# Altium schematic sheet UHF Transceiver Schematic.SchDoc: OCP UHF Transceiver
size Letter; Revision: 1.00; SheetNumber: 1; SheetTotal: 13
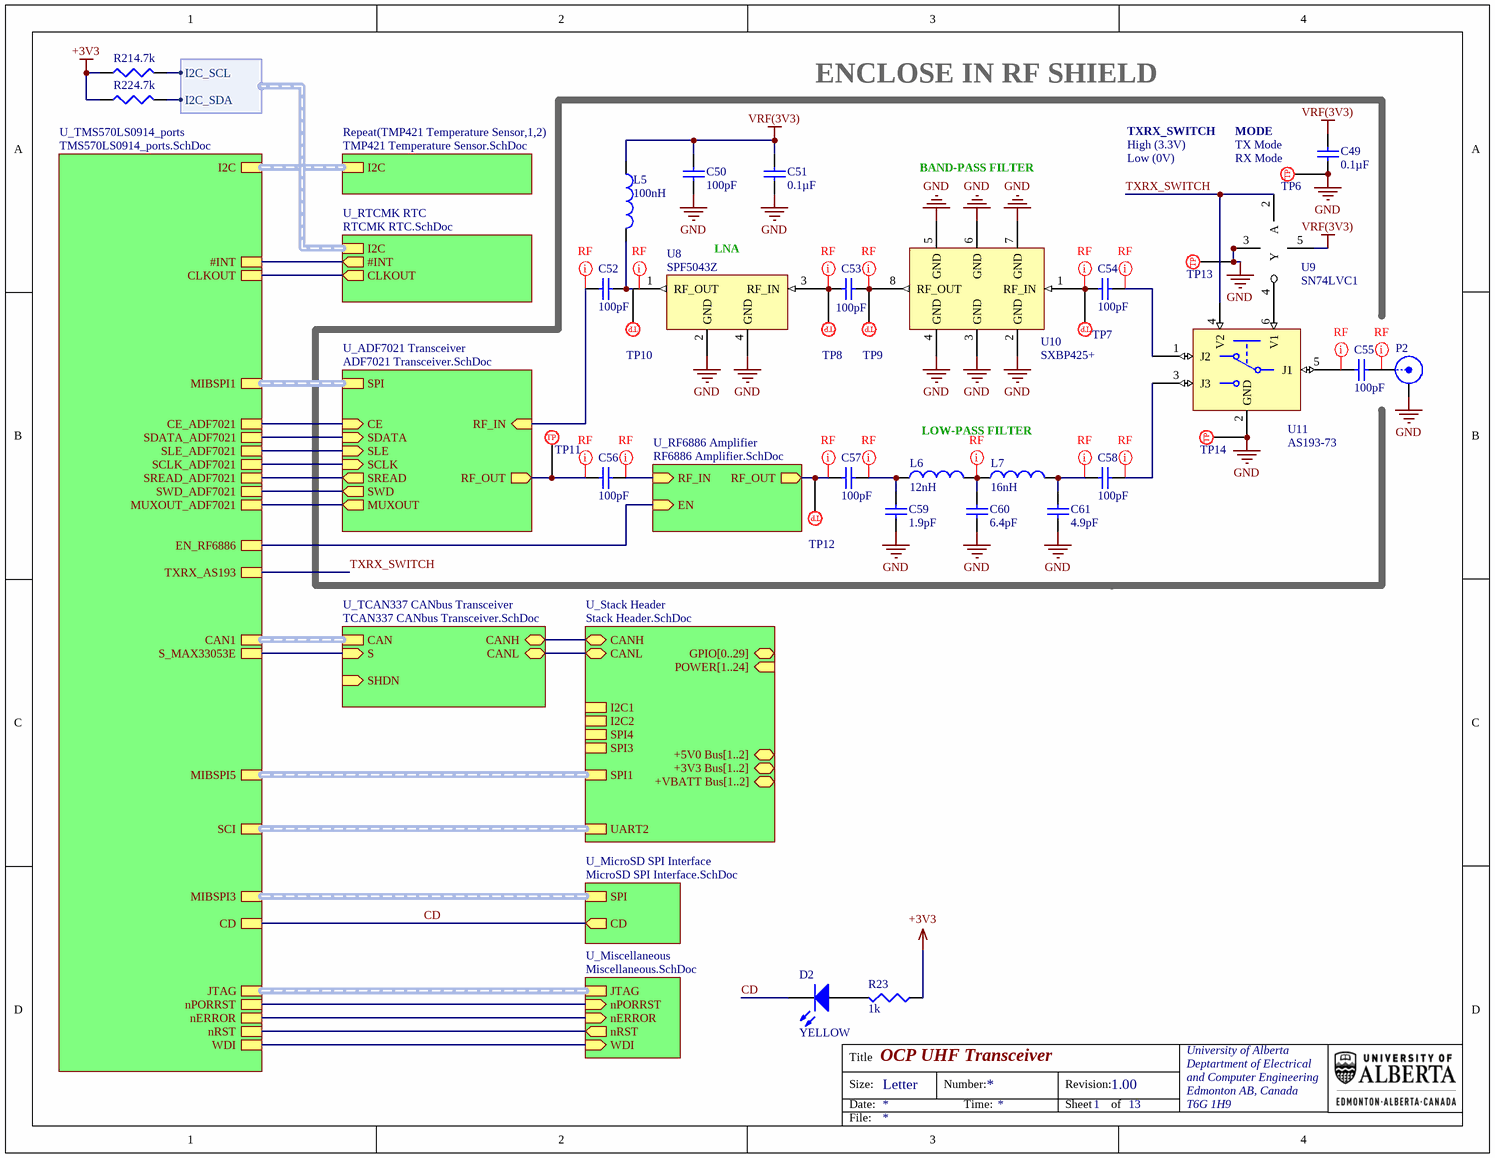
[diagram p0: UHF Transceiver Schematic.SchDoc]

## Parts
C49  value 0.1µF  [TDK-CGA2B]  (hidden comment: Cap)
C50  value 100pF  [KEM-CBR04]  (hidden comment: Cap)
C51  value 0.1µF  [TDK-CGA2B]  (hidden comment: Cap)
C52  value 100pF  [KEM-CBR04]  (hidden comment: Cap)
C53  value 100pF  [KEM-CBR04]  (hidden comment: Cap)
C54  value 100pF  [KEM-CBR04]  (hidden comment: Cap)
C55  value 100pF  [KEM-CBR04]  (hidden comment: Cap)
C56  value 100pF  [KEM-CBR04]  (hidden comment: Cap)
C57  value 100pF  [KEM-CBR04]  (hidden comment: Cap)
C58  value 100pF  [KEM-CBR04]  (hidden comment: Cap)
C59  value 1.9pF  [KEM-CBR04]  (hidden comment: Cap)
C60  value 6.4pF  [KEM-CBR04]  (hidden comment: Cap)
C61  value 4.9pF  [KEM-CBR04]  (hidden comment: Cap)
D2  value YELLOW  [WL-150060XS75000]  (hidden comment: LED)
L5  value 100nH  [TDK-MLF1005]  (hidden comment: MLF1005VR10JTD25)
L6  value 12nH  [MUR-LQW15A]  (hidden comment: LQW15AN12NG8ZD)
L7  value 16nH  [MUR-LQW15A]  (hidden comment: LQW15AN16NG8ZD)
P2  903-518J-51P  [AMP-903-518J-51P]  (value not drawn)
R21  value 4.7k  [PANA-ERJ2R]  (hidden comment: Res3)
R22  value 4.7k  [PANA-ERJ2R]  (hidden comment: Res3)
R23  value 1k  [PANA-ERJ3EK]  (hidden comment: Res3)
TP6  5017  [KS-5017]  (value not drawn)
TP7  5017  [KS-5017]  (value not drawn)
TP8  5017  [KS-5017]  (value not drawn)
TP9  5017  [KS-5017]  (value not drawn)
TP10  5017  [KS-5017]  (value not drawn)
TP11  5017  [KS-5017]  (value not drawn)
TP12  5017  [KS-5017]  (value not drawn)
TP13  5017  [KS-5017]  (value not drawn)
TP14  5017  [KS-5017]  (value not drawn)
U8  SPF5043Z  [QRV-SOT-343-4]
U9  SN74LVC1  [TI-DBV0005A]
U10  SXBP425+  [MICI-SXBP]
U11  AS193-73  [SKYW-SOT-6]

## Sub-sheets
Repeat(TMP421 Temperature Sensor,1,2) = TMP421 Temperature Sensor.SchDoc: I2C (harness MCU_I2C0)
U_ADF7021 Transceiver = ADF7021 Transceiver.SchDoc: RF_OUT (out), RF_IN (in), CE (in), SDATA (in), SREAD (out), SLE (in), SWD (out), SCLK (in), MUXOUT (out), SPI (harness ADF7021_SPI)
U_MicroSD SPI Interface = MicroSD SPI Interface.SchDoc: CD (out), SPI (harness MicroSD_SPI)
U_Miscellaneous = Miscellaneous.SchDoc: JTAG (harness TMS570_JTAG), nRST (out), nERROR (in), nPORRST (in), WDI (in)
U_RF6886 Amplifier = RF6886 Amplifier.SchDoc: RF_IN (in), RF_OUT (out), EN (in)
U_RTCMK RTC = RTCMK RTC.SchDoc: CLKOUT (out), #INT (out), I2C (harness MCU_I2C0)
U_Stack Header = Stack Header.SchDoc: CANH (bidir), CANL (bidir), SPI1 (harness STACK_SPI1), I2C1 (harness STACK_I2C1), SPI3 (harness STACK_SPI3), GPIO[0..29] (bidir), +VBATT Bus[1..2] (bidir), POWER[1..24] (in), SPI4 (harness STACK_SPI0), I2C2 (harness STACK_I2C0), +5V0 Bus[1..2] (bidir), +3V3 Bus[1..2] (bidir), UART2 (harness STACK_UART2)
U_TCAN337 CANbus Transceiver = TCAN337 CANbus Transceiver.SchDoc: CANH (bidir), CANL (bidir), CAN (harness MAX33053E_CAN), S (in), SHDN (in)
U_TMS570LS0914_ports = TMS570LS0914_ports.SchDoc: nRST, nPORRST, SREAD_ADF7021, CE_ADF7021, SWD_ADF7021, MUXOUT_ADF7021, SDATA_ADF7021, SLE_ADF7021, SCLK_ADF7021, TXRX_AS193, CD, #INT, S_MAX33053E, EN_RF6886, CLKOUT, WDI, nERROR, I2C (harness MCU_I2C0), CAN1, MIBSPI5, SCI, MIBSPI1, JTAG, MIBSPI3

## Harnesses
MCU_I2C0: I2C_SCL, I2C_SDA

## Nets
+3V3: R21.1 R22.1 R23.1
GND: C49.2 C50.1 C51.2 C59.1 C60.1 C61.1 P2.2(Y) TP6.1 TP13.1 TP14.1 U8.2(GND) U8.4(GND) U9.1(NC) U9.3(GND) U10.2(GND) U10.3(GND) U10.4(GND) U10.5(GND) U10.6(GND) U10.7(GND) U11.2(GND)
VRF(3V3): C49.1 C50.2 C51.1 L5.1 U9.5(VCC)
CD: D2.2(K) ; sheet U_MicroSD SPI Interface/CD, sheet U_TMS570LS0914_ports/CD
TXRX_SWITCH: U9.2(A) U11.4(V2) ; sheet U_TMS570LS0914_ports/TXRX_AS193
NetC52_1: C52.1 L5.2 TP10.1 U8.1(RF_OUT)
NetC52_2: C52.2 ; sheet U_ADF7021 Transceiver/RF_IN
NetC53_1: C53.1 TP9.1 U10.8(RF_OUT)
NetC53_2: C53.2 TP8.1 U8.3(RF_IN)
NetC54_1: C54.1 U11.1(J2)
NetC54_2: C54.2 TP7.1 U10.1(RF_IN)
NetC55_1: C55.1 P2.1(X)
NetC55_2: C55.2 U11.5(J1)
NetC56_1: C56.1 ; sheet U_RF6886 Amplifier/RF_IN
NetC56_2: C56.2 TP11.1 ; sheet U_ADF7021 Transceiver/RF_OUT
NetC57_1: C57.1 C59.2 L6.1
NetC57_2: C57.2 TP12.1 ; sheet U_RF6886 Amplifier/RF_OUT
NetC58_1: C58.1 U11.3(J3)
NetC58_2: C58.2 C61.2 L7.2
NetC60_2: C60.2 L6.2 L7.1
NetD2_1: D2.1(A) R23.2
NetR21_2: R21.2 ; sheet Repeat(TMP421 Temperature Sensor,1,2)/I2C.I2C_SCL
NetR22_2: R22.2 ; sheet Repeat(TMP421 Temperature Sensor,1,2)/I2C.I2C_SDA
NetU9_4: U9.4(Y) U11.6(V1)
(unnamed): sheet U_RF6886 Amplifier/EN, sheet U_TMS570LS0914_ports/EN_RF6886
(unnamed): sheet U_ADF7021 Transceiver/CE, sheet U_TMS570LS0914_ports/CE_ADF7021
(unnamed): sheet U_ADF7021 Transceiver/SDATA, sheet U_TMS570LS0914_ports/SDATA_ADF7021
(unnamed): sheet U_ADF7021 Transceiver/SREAD, sheet U_TMS570LS0914_ports/SREAD_ADF7021
(unnamed): sheet U_ADF7021 Transceiver/SLE, sheet U_TMS570LS0914_ports/SLE_ADF7021
(unnamed): sheet U_ADF7021 Transceiver/SWD, sheet U_TMS570LS0914_ports/SWD_ADF7021
(unnamed): sheet U_ADF7021 Transceiver/SCLK, sheet U_TMS570LS0914_ports/SCLK_ADF7021
(unnamed): sheet U_ADF7021 Transceiver/MUXOUT, sheet U_TMS570LS0914_ports/MUXOUT_ADF7021
(unnamed): sheet U_RTCMK RTC/CLKOUT, sheet U_TMS570LS0914_ports/CLKOUT
(unnamed): sheet U_RTCMK RTC/#INT, sheet U_TMS570LS0914_ports/#INT
(unnamed): sheet U_Stack Header/CANH, sheet U_TCAN337 CANbus Transceiver/CANH
(unnamed): sheet U_Stack Header/CANL, sheet U_TCAN337 CANbus Transceiver/CANL
(unnamed): sheet U_Miscellaneous/nRST, sheet U_TMS570LS0914_ports/nRST
(unnamed): sheet U_Miscellaneous/nERROR, sheet U_TMS570LS0914_ports/nERROR
(unnamed): sheet U_Miscellaneous/nPORRST, sheet U_TMS570LS0914_ports/nPORRST
(unnamed): sheet U_Miscellaneous/WDI, sheet U_TMS570LS0914_ports/WDI
(unnamed): sheet U_TMS570LS0914_ports/S_MAX33053E, sheet U_TCAN337 CANbus Transceiver/S

## Buses and harness runs
harness sheet Repeat(TMP421 Temperature Sensor,1,2)/I2C = sheet U_RTCMK RTC/I2C = sheet U_TMS570LS0914_ports/I2C
harness sheet U_ADF7021 Transceiver/SPI = sheet U_TMS570LS0914_ports/MIBSPI1
harness sheet U_MicroSD SPI Interface/SPI = sheet U_TMS570LS0914_ports/MIBSPI3
harness sheet U_Miscellaneous/JTAG = sheet U_TMS570LS0914_ports/JTAG
harness sheet U_Stack Header/SPI1 = sheet U_TMS570LS0914_ports/MIBSPI5
harness sheet U_Stack Header/UART2 = sheet U_TMS570LS0914_ports/SCI
harness sheet U_TCAN337 CANbus Transceiver/CAN = sheet U_TMS570LS0914_ports/CAN1

## Layout directives
net class RF; rule Impedance Constraint [Min = 50.00    Max = 50.00    ]: (no net found under the mark), NetC52_2, NetC53_1, NetC53_2, NetC54_1, NetC54_2, NetC55_1, NetC55_2, NetC56_1, NetC56_2, NetC57_1, NetC57_2, NetC58_1, NetC58_2, NetC60_2

## Notes on the sheet
- ENCLOSE IN RF SHIELD
- BAND-PASS FILTER
- TXRX_SWITCH
- High (3.3V)
- Low (0V)
- MODE
- (near TP6) TX Mode
- (near TP6) RX Mode
- (near U8) LNA
- LOW-PASS FILTER
- Title
- Size:
- Date:
- Letter
- Number:
- Time:
- Revision:
- Sheet
- of
- University of Alberta
- Deptartment of Electrical
- and Computer Engineering
- Edmonton AB, Canada
- T6G 1H9
- File:
- (in symbol PTP-KS-00001) TP

## Library data of the parts
C49 C51 = PC-TDK-02259: CAP CER 0.1UF 50V X7R 0402; Manufacturer Part Number: CGA2B3X7R1H104K050BB; Index: 2259; Designator: C?; Tolerance: ±10%; Published: 2016-03-16; LatestRevisionDate: 2016-03-16; LatestRevisionNote: ...; PackageReference: 0402 (1005 Metric); Publisher: AlbertaSat; PackageDescription: Radial Cap, Thru-Hole; 2 Leads; 0.3 in Pin Spacing; Part Number: PC-TDK-02259; Supplier Part Number 1: 445-6899-1-ND; Supplier 1: Digi-key; Supplier Link: http://www.digikey.ca/product-search/en?keywords=445-6899-1-ND; Voltage - Rated: 50V; Temperature Coefficient: X7R; Applications: Automotive
C50 C52-C58 = PC-KEM-03159: CAP CER SMD CBR 0402 100PF 5% 25; Manufacturer Part Number: CBR04C101J3GAC; Index: 3159; Designator: C?; Voltage - Rated: 25V; Temperature Coefficient: C0G, NP0; Published: 2018-08-29; LatestRevisionDate: 2018-08-29; LatestRevisionNote: ...; PackageReference: 0402 (1005 Metric); Publisher: AlbertaSat; PackageDescription: Chip Capacitor, 2-Leads, Body 1.00x0.50mm, IPC Low Density; Part Number: PC-KEM-03159; Supplier Part Number 1: 399-17684-1-ND; Supplier 1: Digi-key; Supplier Link: https://www.digikey.ca/products/en?keywords=399-17684-1-ND; Tolerance: ±5%; Applications: High Q, Low Loss, Ultra Low ESR
C59 = PC-KEM-02905: CAP CER RF 1.9PF 50V +/-0.1 PF C; Manufacturer Part Number: CBR04C199B5GAC; Index: 2905; Designator: C?; Tolerance: ±0.1pF; Temperature Coefficient: C0G, NP0; Published: 2018-08-29; LatestRevisionDate: 2018-08-29; LatestRevisionNote: ...; PackageReference: 0402 (1005 Metric); Publisher: AlbertaSat; PackageDescription: Chip Capacitor, 2-Leads, Body 1.00x0.50mm, IPC Low Density; Part Number: PC-KEM-02905; Supplier Part Number 1: 399-16064-1-ND; Supplier 1: Digi-key; Supplier Link: https://www.digikey.ca/products/en?keywords=399-16064-1-ND; Voltage - Rated: 50V; Applications: High Q, Low Loss, Ultra Low ESR
C60 = PC-KEM-03022: CAP CER RF 6.4PF 50V +/-0.1 PF C; Manufacturer Part Number: CBR04C649B5GAC; Index: 3022; Designator: C?; Tolerance: ±0.1pF; Temperature Coefficient: C0G, NP0; Published: 2018-08-29; LatestRevisionDate: 2018-08-29; LatestRevisionNote: ...; PackageReference: 0402 (1005 Metric); Publisher: AlbertaSat; PackageDescription: Chip Capacitor, 2-Leads, Body 1.00x0.50mm, IPC Low Density; Part Number: PC-KEM-03022; Supplier Part Number 1: 399-16107-1-ND; Supplier 1: Digi-key; Supplier Link: https://www.digikey.ca/products/en?keywords=399-16107-1-ND; Voltage - Rated: 50V; Applications: High Q, Low Loss, Ultra Low ESR
C61 = PC-KEM-02983: CAP CER RF 4.9PF 50V +/-0.1 PF C; Manufacturer Part Number: CBR04C499B5GAC; Index: 2983; Designator: C?; Tolerance: ±0.1pF; Temperature Coefficient: C0G, NP0; Published: 2018-08-29; LatestRevisionDate: 2018-08-29; LatestRevisionNote: ...; PackageReference: 0402 (1005 Metric); Publisher: AlbertaSat; PackageDescription: Chip Capacitor, 2-Leads, Body 1.00x0.50mm, IPC Low Density; Part Number: PC-KEM-02983; Supplier Part Number 1: 399-16093-1-ND; Supplier 1: Digi-key; Supplier Link: https://www.digikey.ca/products/en?keywords=399-16093-1-ND; Voltage - Rated: 50V; Applications: High Q, Low Loss, Ultra Low ESR
D2 = 5: LED YELLOW CLEAR 0603 SMD; Part Number: 5; Manufacturer Part Number: 150060YS75000; Designator: D?; Brightness: 120mcd; Published: 8-Jun-2000; LatestRevisionDate: 08-Jul-2005; LatestRevisionNote: Mech Layer 1 removed.; PackageReference: WL-150060XS75000; Publisher: Altium Limited; PackageDescription: LED; 2 Leads; Supplier Part Number 1: 732-4981-1-ND; Supplier 1: Digi-Key; Supplier Link: http://www.digikey.ca/product-search/en?keywords=732-4981-1-ND
L5 = PL-TDK-02957: FIXD IND 100NH 180MA 510MOHM SMD; Code_IEC: 1005; Index: 2957; Designator: L?; Tolerance: ±5%; Published: 2018-12-12; LatestRevisionDate: 2018-12-12; LatestRevisionNote: ...; PackageReference: 0402 (1005 Metric); Publisher: AlbertaSat; PackageDescription: Chip Inductor, 2-Leads, Body 1.00x0.50mm, IPC Low Density; Code_JEITA: 0402; Part Number: PL-TDK-02957; Manufacturer Part Number: MLF1005VR10JTD25; Supplier Part Number 1: 445-180212-1-ND; Supplier 1: Digi-key; Supplier Part Number 2: 810-MLF1005VR10JTD25; Supplier 2: Mouser; Supplier Link: #https://www.digikey.ca/product-detail/en/tdk-corporation/MLF1005VR10JTD25/445-180212-1-ND/8638399#; Current - Rated: 180mA
L6 = 10160: FIXED IND 12NH 1.24A 93 MOHM; Part Number: 10160; Code_IEC: 1005; Designator: L?; DC Resistance: 93 mOhm Max; Tolerance: ±2%; Published: 8-Jun-2000; LatestRevisionDate: 29-May-2009; LatestRevisionNote: IPC-7351 Footprint Added.; PackageReference: 0402 (1005 Metric); Publisher: Altium Limited; PackageDescription: Chip Inductor, 2-Leads, Body 1.00x0.60mm, IPC Low Density; Code_JEITA: 0402; Manufacturer Part Number: LQW15AN12NG8ZD; Supplier Part Number 1: 490-15335-1-ND; Supplier 1: Digi-Key; Supplier Link: #https://www.digikey.ca/product-detail/en/murata-electronics-north-america/LQW15AN12NG8ZD/490-15335-1-ND/6800000#
L7 = 10161: FIXED IND 16NH 1A 126 MOHM; Part Number: 10161; Code_IEC: 1005; Designator: L?; DC Resistance: 126 mOhm Max; Tolerance: ±2%; Published: 8-Jun-2000; LatestRevisionDate: 29-May-2009; LatestRevisionNote: IPC-7351 Footprint Added.; PackageReference: 0402 (1005 Metric); Publisher: Altium Limited; PackageDescription: Chip Inductor, 2-Leads, Body 1.00x0.60mm, IPC Low Density; Code_JEITA: 0402; Manufacturer Part Number: LQW15AN16NG8ZD; Supplier Part Number 1: 490-15343-1-ND; Supplier 1: Digi-Key; Supplier Link: #https://www.digikey.ca/product-detail/en/murata-electronics-north-america/LQW15AN16NG8ZD/490-15343-1-ND/6800008#
P2 = PP-AMP-00002: CONN SMB JACK STR 50OHM EDGE MNT; Index: 2; Designator: P?; LatestRevisionDate: 2018-12-20; LatestRevisionNote: ...; Publisher: AlbertaSat; Part Number: PP-AMP-00002; Manufacturer Part Number: 903-518J-51P; Supplier Part Number 1: ARF1721-ND; Supplier 1: Digi-key; Supplier Part Number 2: 523-903-518J-51P; Supplier 2: Mouser; Published: 2018-12-20; PackageReference: CONN SMB JACK STR 50OHM EDGE MNT; PackageDescription: CONN SMB JACK STR 50OHM EDGE MNT; Supplier Link: #https://www.digikey.ca/product-detail/en/amphenol-rf-division/903-518J-51P/ARF1721-ND/2041847#
R21 R22 = 16657: RES SMD 4.7K OHM 1% 1/10W 0402; Part Number: 16657; Manufacturer Part Number: ERJ-2RKF4701X; Designator: R?; Power: 0.1W, 1/10W; Temperature Coefficient: ±100ppm/°C; Published: 8-Jun-2000; LatestRevisionDate: 29-May-2009; LatestRevisionNote: IPC-7351 Footprint Added.; PackageReference: 0402 (1005 Metric); Publisher: Altium Limited; PackageDescription: Chip Resistor, 2-Leads, Body 1.00x0.50mm, IPC Low Density; Supplier Part Number 1: P4.70KLCT-ND; Supplier 1: Digi-Key; Supplier Link: http://www.digikey.ca/product-search/en?keywords=P4.70KLCT-ND; Tolerance: ±1%
R23 = 15398: RES SMD 1K OHM 1% 1/10W 0603; Part Number: 15398; Manufacturer Part Number: ERJ-3EKF1001V; Designator: R?; Power: 0.1W, 1/10W; Temperature Coefficient: ±100ppm/°C; Published: 8-Jun-2000; LatestRevisionDate: 29-May-2009; LatestRevisionNote: IPC-7351 Footprint Added.; PackageReference: 0603 (1608 Metric); Publisher: Altium Limited; PackageDescription: Chip Resistor, 2-Leads, Body 1.60x0.80mm, IPC Low Density; Supplier Part Number 1: P1.00KHCT-ND; Supplier 1: Digi-Key; Supplier Link: http://www.digikey.ca/product-search/en?keywords=P1.00KHCT-ND; Tolerance: ±1%
TP6-TP14 = PTP-KS-00001: PC TEST POINT MINI SMD; Index: 1; Designator: TP?; Supplier 1: Digi-key; Supplier 2: Newark; Supplier 3: Mouser; Part Number: PTP-KS-00001; Manufacturer Part Number: 5017; Supplier Part Number 1: 36-5017CT-ND; Publisher: AlbertaSat; Published: 2016-03-15; LatestRevisionDate: 2016-03-15; LatestRevisionNote: ...; PackageReference: KS-5017; PackageDescription: Testpoint Lug Mini SMD 27X10X152; Supplier Link: #http://www.digikey.ca/product-detail/en/keystone-electronics/5017/36-5017TR-ND/2217304#
U8 = PU-QRV-00002: RF Amplifier .05-4GHz SSG 12.9dB NF .8dB GaAs; Index: 2; Designator: U?; Opperating Supply Current: 46 mA; Operating Frequency: 50 MHz to 4 GHz; Operating Supply Voltage: 5V; Part Number: PU-QRV-00002; Manufacturer Part Number: SPF5043Z; Supplier Part Number 1: 772-SPF5043Z; Supplier 1: Mouser; Supplier Part Number 2: SPF5043Z; Supplier 2: Avnet Asia; Publisher: AlbertaSat; Published: 2018-05-28; LatestRevisionDate: 2018-05-28; LatestRevisionNote: ...; PackageReference: SOT-343-4; PackageDescription: SOT143, 4-Leads, Body 2.00x2.10mm, Pitch 1.30mm, IPC Medium Density; Supplier Link: #https://www.mouser.ca/ProductDetail/Qorvo/SPF5043Z?qs=p6lVfQR1GSoUob90DTnCEA%3D%3D#; Gain: 12.9 dB; Operating Temperature: -40°C ~ 85°C (TA; Applications: Wireless & RF Integrated Circuits
U9 = 52: IC INVERTER SCHMITT 1CH SOT23-5; Part Number: 52; Manufacturer Part Number: SN74LVC1G14MDBVREP; Designator: U?; Voltage - Supply: 1.65 V ~ 5.5 V; Current - Output (Max): ±50 mA; Supplier Part Number 2: 595-SN74LVC14MDBVREP; Supplier 2: Mouser; Supplier Part Number 1: 296-22346-1-ND; Supplier 1: Digi-Key; Supplier Link: #https://www.digikey.ca/products/en?keywords=296-22346-1-ND#; PackageReference: SOT-23-5, SC-74A, SOT-753; Operating Temperature: -55°C ~ 125°C
U10 = PU-MICI-00002: Band Pass Filter; Index: 2; Designator: U?; PassBand: 410 to 440 MHz; Part Number: PU-MICI-00002; Manufacturer Part Number: SXBP-425+; Supplier Part Number 1: SXBP-425+; Supplier 1: Mini Circuits; Publisher: AlbertaSat; Published: 2018-12-19; LatestRevisionDate: 2018-12-19; LatestRevisionNote: ...; Supplier Link: #https://www.minicircuits.com/WebStore/dashboard.html?model=SXBP-425%2B#
U11 = PU-SKYW-00003: IC SW SPDT 0.1-2.5GHZ SOT6; Manufacturer Part Number: AS193-73LF; Index: 3; Designator: U?; Part Number: PU-SKYW-00003; Supplier Part Number 1: 863-1006-1-ND; Supplier 1: Digi-key; Supplier Part Number 2: 873-AS193-73LF; Supplier 2: Mouser; Publisher: AlbertaSat; Published: 2018-05-18; LatestRevisionDate: 2018-05-18; LatestRevisionNote: ...; PackageReference: SOT-23 6L; PackageDescription: SOT23, 6-Leads, Body 2.90x2.70mm, Pitch 0.95mm, IPC Medium Density; Supplier Link: #https://www.digikey.ca/products/en?keywords=863-1006-1-ND#